# Altium schematic sheet Cover.SchDoc
size A3; ApprovedBy: Siz Değerli Öğrenciler; CheckedBy: UDEMY; Organization: Altium Limited; Address1: L3, 12a Rodborough Rd; Address2: Frenchs Forest; Address3: NSW; Address4: Australia 2086; Revision: AA; SheetNumber: 1; SheetTotal: 5; PreparedBy: M. Berk AYDOĞAN; ProjectDescription: Wireless Security Detector
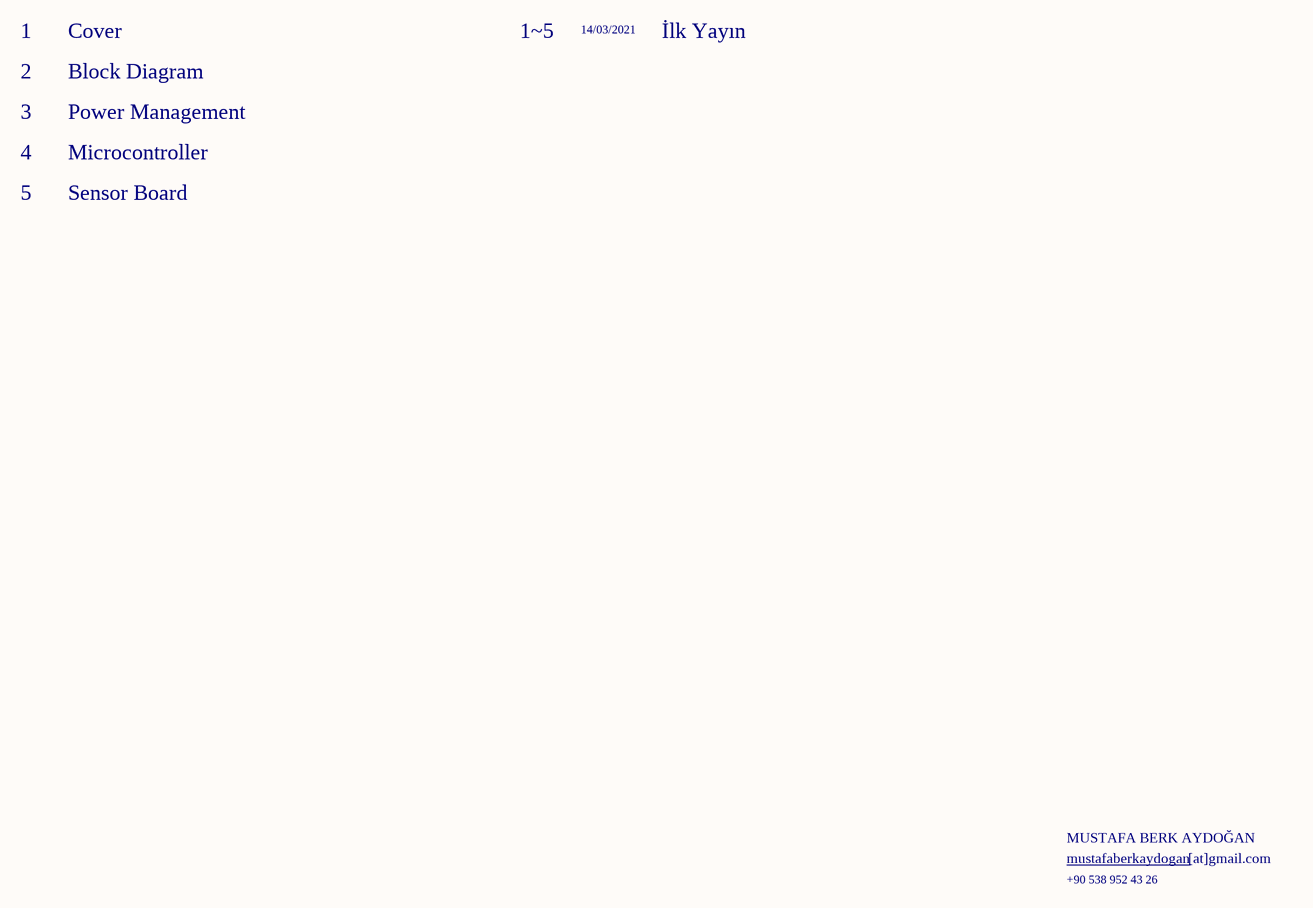
[diagram p0: Cover.SchDoc]

## Notes on the sheet
- 1
- Cover
- 1~5
- 14/03/2021
- İlk Yayın
- 2
- Block Diagram
- 3
- 4
- Power Management
- Microcontroller
- 5
- Sensor Board
- MUSTAFA BERK AYDOĞAN
- mustafaberkaydogan
- +90 538 952 43 26
- [at]gmail.com
- İÇİNDEKİLER / CONTENTS
- REVİZYON / REVISION
- ÜRETİM NOTLARI / PRODUCTION NOTES
- Sayfa Nu.
- Page No
- Açıklama / Description
- Tarih
- Date
- Kart Özellikleri
- Board Features
- Üretim Çıktıları
- Gerber Files
- Ekler
- Attachments
- İLETİŞİM / CONTACT
- DOSYA ADI / FILE NAME
- HAZIRLAYAN / PREPARED BY
- TANIM / DESCRIPTION
- YAYIN TARİHİ / REL. DATE
- KONTROL EDEN / CHECKED BY
- DEĞ. TARİHİ / CHANGE DATE
- ONAYLAYAN / APPROVED BY
- BÖLÜM / DEPARTMENT
- BOYUT / SIZE
- SAYFA / SHEET
- /
- R&D- Hardware
- A3